# EAGLE schematic backup (EAGLE 7.1.0)
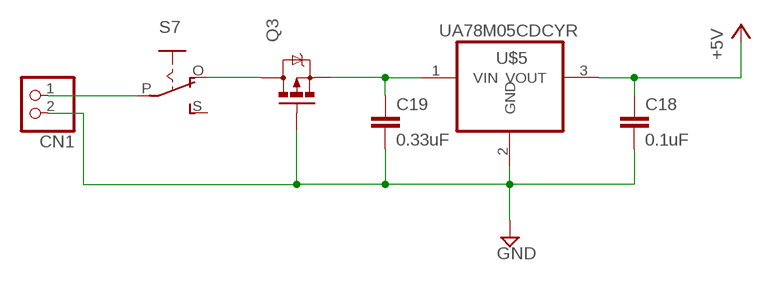
[diagram p0: schematic, sheet 1]

## Parts
C18  0.1uF  1.0UF-25V-+80/-20(0805)  [0805]
C19  0.33uF  1.0UF-25V-+80/-20(0805)  [0805]
CN1  JST_2PIN-THM-RA  [JST-PH-2-THM-RA]
Q3  MOSFET-PCHANNELDMG2307L  [SOT23-3]
S7  EG1218S  [EG1218]
U$5  UA78M05CDCYR  [SOT223]

## Nets
+5V [+5V]: C18.1 U$5.3(VOUT)
GND: C18.2 C19.2 CN1.2 Q3.1(G) U$5.2(GND)
N$11: C19.1 Q3.2(S) U$5.1(VIN)
N$13: Q3.3(D) S7.O
N$15: CN1.1 S7.P
Unconnected: S7.S

## Library data of the parts
C18 C19 = SparkFun-Capacitors:1.0UF-25V-+80/-20(0805): CAP-11625; PROD_ID: CAP-11625; VALUE: 1.0uF
CN1 = adafruit:JST_2PIN: JST 2-Pin Connectors of various flavors SMT-RA (S2B-PH-SM4) 4UConnector #17311 SMT (B2B-PH-SM4) THM-RA (S2B-PH) THM (B2B-PH)
Q3 = SparkFun-DiscreteSemi:MOSFET-PCHANNEL: Generic PMOSFET IRLML2244 - TRANS-11153 (SOT-23 -20V -4.3A) (1.Gate 2.Source 3.Drain) FQP27P06 - COM-10349 <http://www.sparkfun.com/products/10349> (TO-220 -60V -27A) (1.Gate 2.Source 3.Drain); PROD_ID: TRANS-11308; VALUE: 30V, 2.5A
S7 = adafruit:EG1218: SLIDING SWITCH 0.1" spacing through hole, vertical SPDT slide switch http://www.ladyada.net/library/pcb/eaglelibrary.html
U$5 = custom-spave:UA78M05CDCYR: 500mA Low Dropout (LDO) Positive Regulator IN: 7 V ~ 25 V OUT: 5V

## Net classes
2 +5V: width 0.305 mm